# EAGLE schematic skyshieldv0.3 (EAGLE 7.2.0)
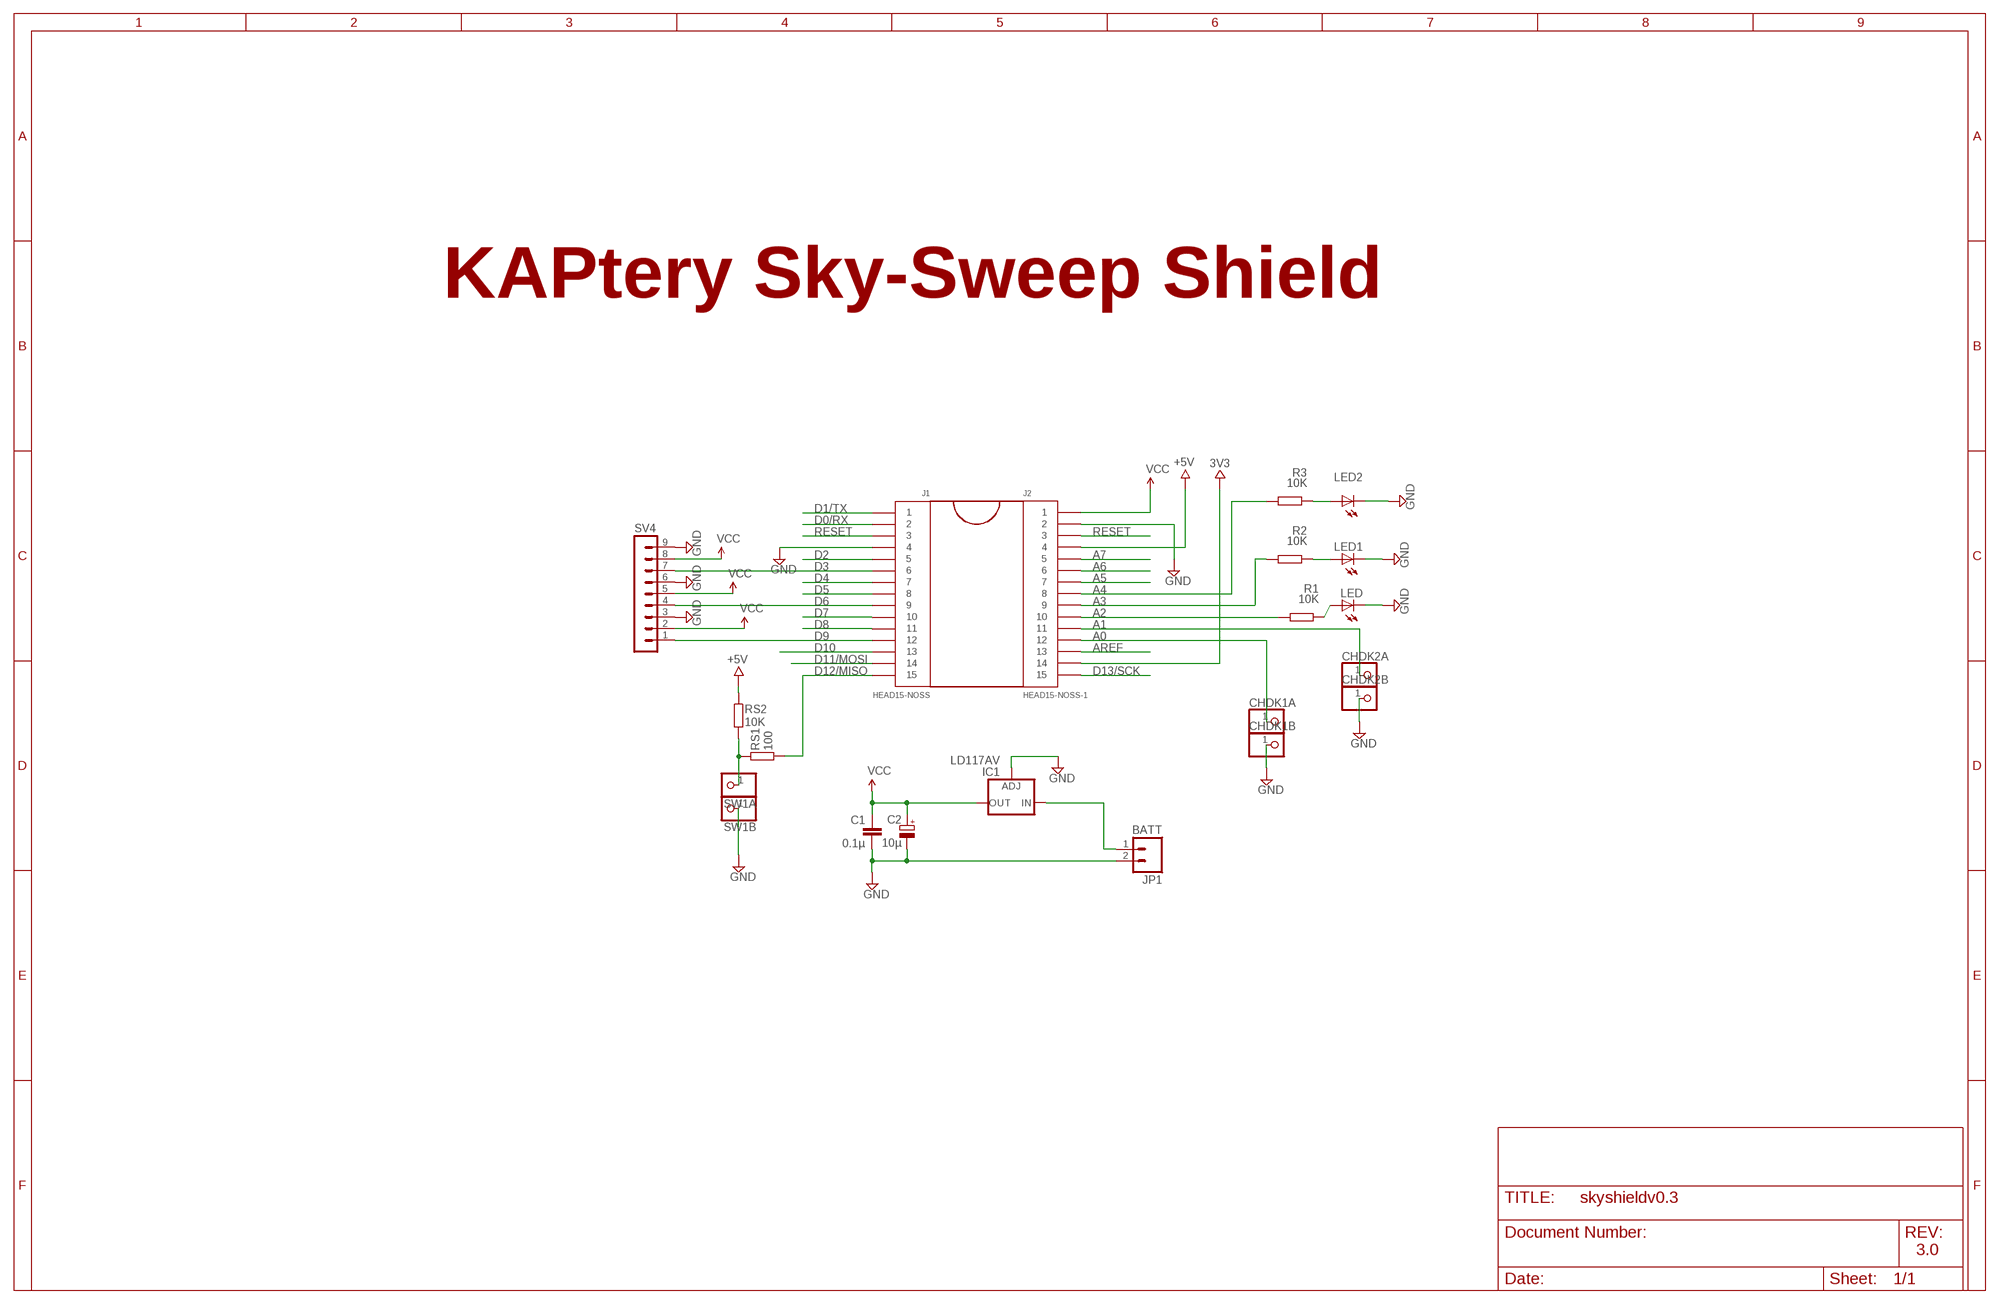
[diagram p0: schematic, sheet 1]

## Parts
C1  0.1µ  C-EU025-024X044  [C025-024X044]
C2  10µ  CPOL-EUE1.8-4  [E1,8-4]
CHDK1A  PINHD-1X1  [1X01]
CHDK1B  PINHD-1X1  [1X01]
CHDK2A  PINHD-1X1  [1X01]
CHDK2B  PINHD-1X1  [1X01]
IC1  LD117AV  [TO220L1]
J1  HEAD15-NOSS  [HEAD15-NOSS]
J2  HEAD15-NOSS-1  [HEAD15-NOSS-1]
JP1  BATT  M02LOCK_LONGPADS  [1X02_LOCK_LONGPADS]
LED  POWERLED  LED3MM  [LED3MM]
LED1  POWERLED  LED3MM  [LED3MM]
LED2  POWERLED  LED3MM  [LED3MM]
R1  10K  R-EU_0204/7  [0204/7]
R2  10K  R-EU_0204/7  [0204/7]
R3  10K  R-EU_0204/7  [0204/7]
RS1  100  R-EU_0204/7  [0204/7]
RS2  10K  R-EU_0204/7  [0204/7]
SV4  MA09-1  [MA09-1]
SW1A  PINHD-1X1  [1X01]
SW1B  PINHD-1X1  [1X01]

## Nets
3V3: J2.14
+5V: J2.4 RS2.1
A0: CHDK1A.1 J2.12
A1: CHDK2A.1 J2.11
A2: J2.10 R1.1
A3: J2.9 R2.1
A4: J2.8 R3.1
A5: J2.7
A6: J2.6
A7: J2.5
AREF: J2.13
D0/RX: J1.2
D1/TX: J1.1
D2: J1.5
D3: J1.6 SV4.7
D4: J1.7
D5: J1.8
D6: J1.9 SV4.4
D7: J1.10
D8: J1.11
D9: J1.12 SV4.1
D10: J1.13
D11/MOSI: J1.14
D12/MISO: J1.15 RS1.2
D13/SCK: J2.15
GND [power]: C1.2 C2.- CHDK1B.1 CHDK2B.1 IC1.1(ADJ) J1.4 J2.2 JP1.2 LED1.K(C) LED2.K(C) LED.K(C) SV4.3 SV4.6 SV4.9 SW1B.1
N$1: LED2.A R3.2
N$2: LED1.A R2.2
N$3: LED.A R1.2
N$4: RS1.1 RS2.2 SW1A.1
N$6: IC1.3(IN) JP1.1
RESET: J1.3 J2.3
VCC [power]: C1.1 C2.+ IC1.2(OUT) J2.1 SV4.2 SV4.5 SV4.8

## Notes on the sheet
- KAPtery Sky-Sweep Shield
- 3.0

## Library data of the parts
C1 = resistor:C-EU: CAPACITOR, European symbol
C2 = resistor:CPOL-EU: POLARIZED CAPACITOR, European symbol
CHDK1A CHDK1B CHDK2A CHDK2B SW1A SW1B = pinhead:PINHD-1X1: PIN HEADER
IC1 = v-reg:LD117A?*: Low drop fixed and adjustable positive voltage regulators 1 A Source: http://www.st.com/stonline/products/literature/ds/7194/ld1117axx.pdf
J1 = MyCON2:HEAD15-NOSS
J2 = MyCON2:HEAD15-NOSS-1
JP1 = SparkFun:M02: Header 2 Standard 2-pin 0.1" header. Use with straight break away headers (SKU : PRT-00116), right angle break away headers (PRT-00553), swiss pins (PRT-00743), machine pins (PRT-00117), and female headers (PRT-00115). Molex polarized connector foot print use with SKU : PRT-08233 with associated crimp pins and housings.
LED LED1 LED2 = adafruit:LED: LED OSRAM: - CHIPLED LG R971, LG N971, LY N971, LG Q971, LY Q971, LO R971, LY R971 LH N974, LH R974 LS Q976, LO Q976, LY Q976 LO Q996 - Hyper CHIPLED LW Q18S LB Q993, LB Q99A, LB R99A - SideLED LS A670, LO A670, LY A670, LG A670, LP A670 LB A673, LV A673, LT A673, LW A673 LH A674 LY A675 LS A676, LA A676, LO A676, LY A676, LW A676 LS A679, LY A679, LG A679 - Hyper Micro SIDELED® LS Y876, LA Y876, LO Y876, LY Y876 LT Y87S - SmartLED LW L88C, LW L88S LB L89C, LB L89S, LG L890 LS L89K, LO L89K, LY L89K LS L896, LA L896, LO L896, LY L896 - TOPLED LS T670, LO T670, LY T670, LG T670, LP T670 LSG T670, LSP T670, LSY T670, LOP T670, LYG T670 LG T671, LOG T671, LSG T671 LB T673, LV T673, LT T673, LW T673 LH T674 LS T676, LA T676, LO T676, LY T676, LB T676, LH T676, LSB T676, LW T676 LB T67C, LV T67C, LT T67C, LS T67K, LO T67K, LY T67K, LW E67C LS E67B, LA E67B, LO E67B, LY E67B, LB E67C, LV E67C, LT E67C LW T67C LS T679, LY T679, LG T679 LS T770, LO T770, LY T770, LG T770, LP T770 LB T773, LV T773, LT T773, LW T773 LH T774 LS E675, LA E675, LY E675, LS T675 LS T776, LA T776, LO T776, LY T776, LB T776 LHGB T686 LT T68C, LB T68C - Hyper Mini TOPLED® LB M676 - Mini TOPLED Santana® LG M470 LS M47K, LO M47K, LY M47K Source: http://www.osram.convergy.de/
R1-R3 RS1 RS2 = rcl:R-EU_: RESISTOR, European symbol
SV4 = con-lstb:MA09-1: PIN HEADER; OC_FARNELL: unknown; OC_NEWARK: unknown

## Net classes
0 default: width 0.406 mm, clearance 0.203 mm
1 power: width 0.813 mm, clearance 0.203 mm